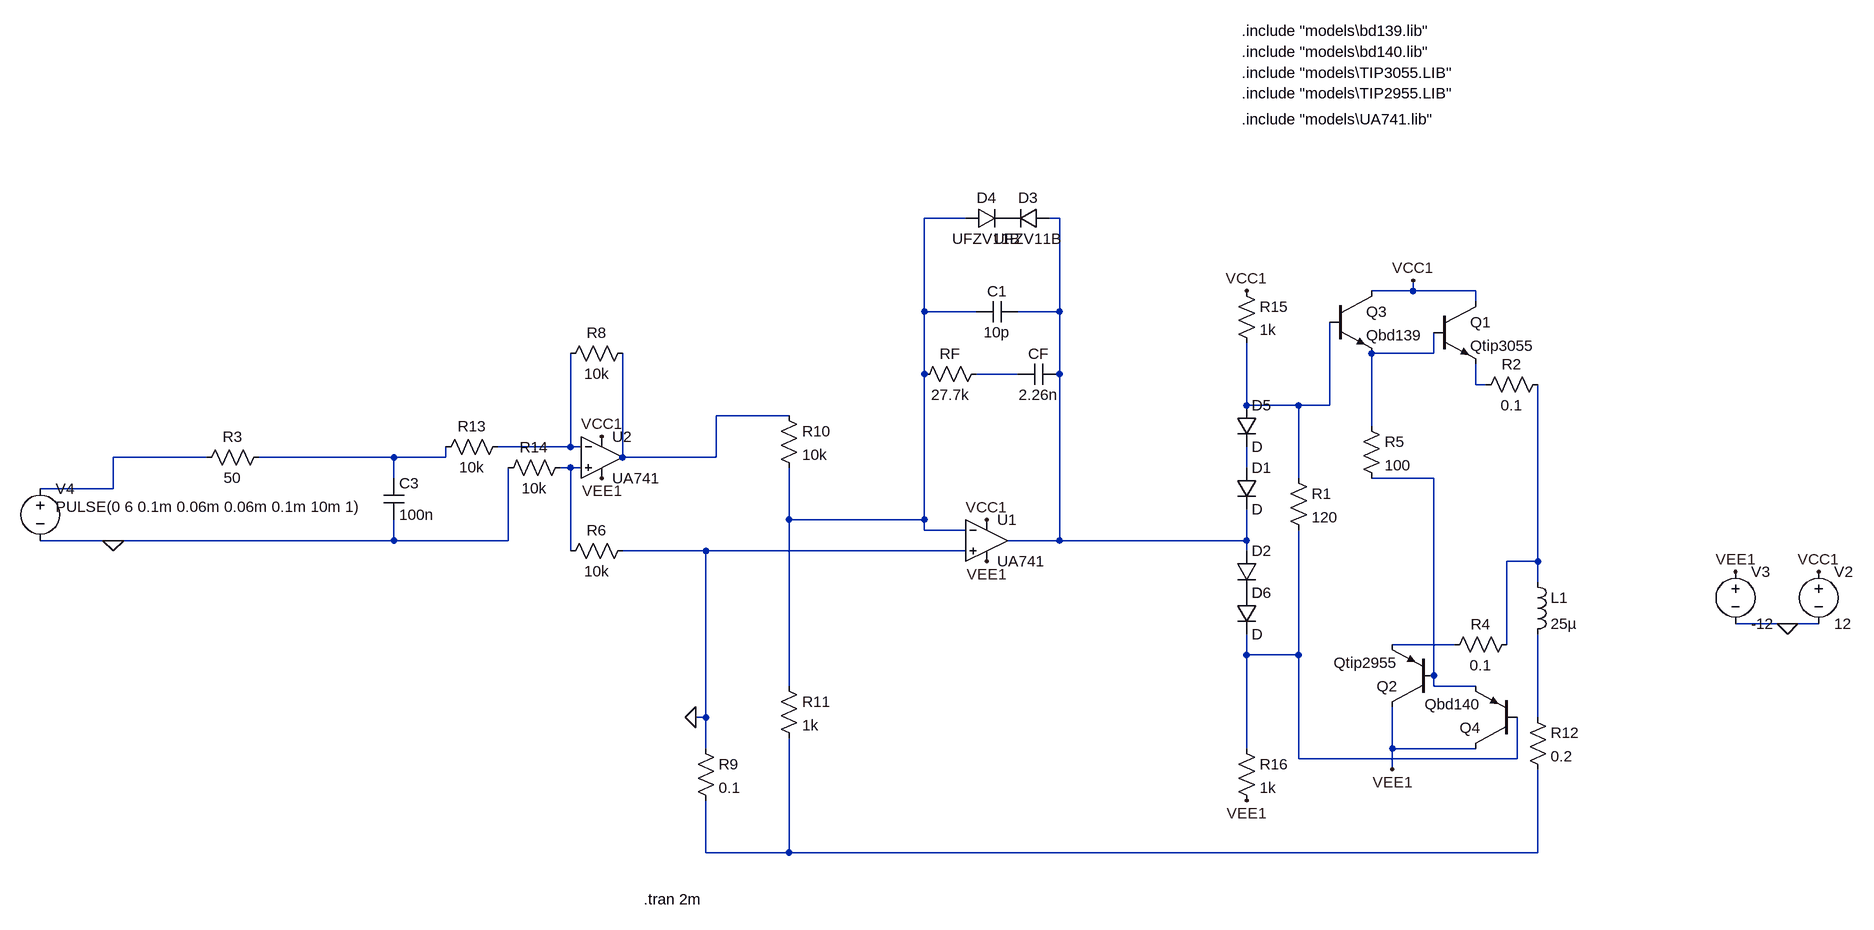
[diagram p0: schematic BJT V1.5.asc]
BJT V1.5.asc, the LTspice schematic file:
Version 4.1
SHEET 1 2440 888
WIRE 688 -176 624 -176
WIRE 832 -176 816 -176
WIRE 1376 -64 1376 -80
WIRE 1376 -64 1312 -64
WIRE 1472 -64 1376 -64
WIRE 1472 -48 1472 -64
WIRE 624 -32 624 -176
WIRE 704 -32 624 -32
WIRE 832 -32 832 -176
WIRE 832 -32 768 -32
WIRE 1408 32 1408 0
WIRE 1408 32 1312 32
WIRE 624 64 624 -32
WIRE 768 64 704 64
WIRE 832 64 832 -32
WIRE 1472 80 1472 48
WIRE 1488 80 1472 80
WIRE 1120 112 1120 16
WIRE 1200 112 1120 112
WIRE 1248 112 1248 -16
WIRE 1248 112 1200 112
WIRE 416 128 304 128
WIRE 1312 144 1312 32
WIRE 80 176 80 32
WIRE 80 176 -32 176
WIRE 96 176 80 176
WIRE -480 192 -624 192
WIRE -192 192 -400 192
WIRE -112 192 -112 176
WIRE -112 192 -192 192
WIRE 160 192 160 32
WIRE 304 192 304 128
WIRE 304 192 160 192
WIRE 80 208 64 208
WIRE 96 208 80 208
WIRE 1120 208 1120 176
WIRE -192 224 -192 192
WIRE 1200 224 1200 112
WIRE 1408 224 1312 224
WIRE -624 240 -624 192
WIRE -624 240 -736 240
WIRE 416 288 416 208
WIRE 624 288 624 64
WIRE 624 288 416 288
WIRE 624 304 624 288
WIRE 688 304 624 304
WIRE -624 320 -736 320
WIRE -192 320 -192 288
WIRE -192 320 -624 320
WIRE -16 320 -16 208
WIRE -16 320 -192 320
WIRE 832 320 832 64
WIRE 832 320 752 320
WIRE 1120 320 1120 272
WIRE 1120 320 832 320
WIRE 80 336 80 208
WIRE 288 336 160 336
WIRE 688 336 288 336
WIRE 1120 336 1120 320
WIRE 1568 352 1568 80
WIRE 1568 352 1520 352
WIRE 1568 384 1568 352
WIRE 1952 448 1872 448
WIRE 2000 448 1952 448
WIRE 1440 480 1344 480
WIRE 1520 480 1520 352
WIRE 1120 496 1120 464
WIRE 1200 496 1200 304
WIRE 1200 496 1120 496
WIRE 1408 528 1408 224
WIRE 416 544 416 288
WIRE 1408 544 1408 528
WIRE 1472 544 1408 544
WIRE 288 592 288 336
WIRE 288 592 272 592
WIRE 1568 592 1568 464
WIRE 288 640 288 592
WIRE 1120 640 1120 496
WIRE 1344 640 1344 576
WIRE 1472 640 1344 640
WIRE 1200 656 1200 496
WIRE 1536 656 1536 592
WIRE 1536 656 1200 656
WIRE 1344 672 1344 640
WIRE 288 800 288 720
WIRE 416 800 416 624
WIRE 416 800 288 800
WIRE 1568 800 1568 672
WIRE 1568 800 416 800
FLAG 2000 368 VCC1
FLAG 1872 368 VEE1
FLAG 1376 -80 VCC1
FLAG 1344 672 VEE1
FLAG 1120 -64 VCC1
FLAG 1120 720 VEE1
FLAG 720 288 VCC1
FLAG 720 352 VEE1
FLAG 272 592 0
FLAG 128 160 VCC1
FLAG 128 224 VEE1
FLAG -624 320 0
FLAG 1952 448 0
SYMBOL res 272 624 R0
SYMATTR InstName R9
SYMATTR Value 0.1
SYMBOL res 400 112 R0
SYMATTR InstName R10
SYMATTR Value 10k
SYMBOL res 400 528 R0
SYMATTR InstName R11
SYMATTR Value 1k
SYMBOL cap 768 -48 R90
WINDOW 0 0 32 VBottom 2
WINDOW 3 32 32 VTop 2
SYMATTR InstName C1
SYMATTR Value 10p
SYMBOL cap 832 48 R90
WINDOW 0 0 32 VBottom 2
WINDOW 3 32 32 VTop 2
SYMATTR InstName CF
SYMATTR Value 2.26n
SYMBOL res 720 48 R90
WINDOW 0 0 56 VBottom 2
WINDOW 3 32 56 VTop 2
SYMATTR InstName RF
SYMATTR Value 27.7k
SYMBOL npn 1408 -48 R0
SYMATTR InstName Q1
SYMATTR Value Qtip3055
SYMBOL pnp 1408 576 R180
SYMATTR InstName Q2
SYMATTR Value Qtip2955
SYMBOL diode 1104 208 R0
SYMATTR InstName D1
SYMBOL diode 1104 336 R0
SYMATTR InstName D2
SYMBOL ind 1552 368 R0
SYMATTR InstName L1
SYMATTR Value 25µ
SYMATTR SpiceLine Rser=1m
SYMBOL res 1552 576 R0
SYMATTR InstName R12
SYMATTR Value 0.2
SYMBOL voltage 2000 352 R0
WINDOW 123 0 0 Left 0
WINDOW 39 0 0 Left 0
SYMATTR InstName V2
SYMATTR Value 12
SYMBOL voltage 1872 352 R0
WINDOW 123 0 0 Left 0
WINDOW 39 0 0 Left 0
SYMATTR InstName V3
SYMATTR Value -12
SYMBOL res 1104 -80 R0
SYMATTR InstName R15
SYMATTR Value 1k
SYMBOL res 1104 624 R0
SYMATTR InstName R16
SYMATTR Value 1k
SYMBOL npn 1248 -64 R0
SYMATTR InstName Q3
SYMATTR Value Qbd139
SYMBOL diode 1104 112 R0
SYMATTR InstName D5
SYMBOL diode 1104 400 R0
SYMATTR InstName D6
SYMBOL pnp 1536 640 R180
SYMATTR InstName Q4
SYMATTR Value Qbd140
SYMBOL voltage -736 224 R0
WINDOW 123 0 0 Left 0
WINDOW 39 0 0 Left 0
WINDOW 3 24 44 Left 2
SYMATTR Value PULSE(0 6 0.1m 0.06m 0.06m 0.1m 10m 1)
SYMATTR InstName V4
SYMBOL res -384 176 R90
WINDOW 0 0 56 VBottom 2
WINDOW 3 32 56 VTop 2
SYMATTR InstName R3
SYMATTR Value 50
SYMBOL OpAmps\\opamp2 720 256 R0
SYMATTR InstName U1
SYMATTR Value UA741
SYMBOL res 1184 208 R0
SYMATTR InstName R1
SYMATTR Value 120
SYMBOL res 1584 64 R90
WINDOW 0 0 56 VBottom 2
WINDOW 3 32 56 VTop 2
SYMATTR InstName R2
SYMATTR Value 0.1
SYMBOL res 1536 464 R90
WINDOW 0 0 56 VBottom 2
WINDOW 3 32 56 VTop 2
SYMATTR InstName R4
SYMATTR Value 0.1
SYMBOL res 1296 128 R0
SYMATTR InstName R5
SYMATTR Value 100
SYMBOL diode 816 -192 R90
WINDOW 0 0 32 VBottom 2
WINDOW 3 32 32 VTop 2
SYMATTR InstName D3
SYMATTR Value UFZV11B
SYMBOL diode 688 -160 R270
WINDOW 0 32 32 VTop 2
WINDOW 3 0 32 VBottom 2
SYMATTR InstName D4
SYMATTR Value UFZV11B
SYMBOL OpAmps\\opamp2 128 128 R0
SYMATTR InstName U2
SYMATTR Value UA741
SYMBOL res 176 320 R90
WINDOW 0 0 56 VBottom 2
WINDOW 3 32 56 VTop 2
SYMATTR InstName R6
SYMATTR Value 10k
SYMBOL res 176 16 R90
WINDOW 0 0 56 VBottom 2
WINDOW 3 32 56 VTop 2
SYMATTR InstName R8
SYMATTR Value 10k
SYMBOL res -16 160 R90
WINDOW 0 0 56 VBottom 2
WINDOW 3 32 56 VTop 2
SYMATTR InstName R13
SYMATTR Value 10k
SYMBOL res 80 192 R90
WINDOW 0 0 56 VBottom 2
WINDOW 3 32 56 VTop 2
SYMATTR InstName R14
SYMATTR Value 10k
SYMBOL cap -208 224 R0
SYMATTR InstName C3
SYMATTR Value 100n
TEXT 192 872 Left 2 !.tran 2m
TEXT 1112 -328 Left 2 !.include "models\\UA741.lib"
TEXT 1112 -368 Left 2 !.include "models\\TIP2955.LIB"
TEXT 1112 -400 Left 2 !.include "models\\TIP3055.LIB"
TEXT 1112 -432 Left 2 !.include "models\\bd140.lib"
TEXT 1112 -464 Left 2 !.include "models\\bd139.lib"

The netlist it stands for:
* BJT V1.5.asc
R9 0 N018 0.1
R10 N007 N001 10k
R11 N001 N018 1k
C1 N002 N001 10p
CF N002 N004 2.26n
RF N004 N001 27.7k
Q1 VCC1 N003 N005 0 Qtip3055
Q2 VEE1 N013 N015 0 Qtip2955
D1 N012 N002 D
D2 N002 P001 D
L1 N014 N017 25µ Rser=1m
R12 N017 N018 0.2
V2 VCC1 0 12
V3 VEE1 0 -12
R15 VCC1 N006 1k
R16 N016 VEE1 1k
Q3 VCC1 N006 N003 0 Qbd139
D5 N006 N012 D
D6 P001 N016 D
Q4 VEE1 N016 N013 0 Qbd140
V4 N009 0 PULSE(0 6 0.1m 0.06m 0.06m 0.1m 10m 1)
R3 N010 N009 50
X§U1 0 N001 VCC1 VEE1 N002 UA741  ; pins In+ In- V+ V- OUT
R1 N006 N016 120
R2 N014 N005 0.1
R4 N014 N015 0.1
R5 N003 N013 100
D3 N002 P002 UFZV11B
D4 N001 P002 UFZV11B
X§U2 N011 N008 VCC1 VEE1 N007 UA741  ; pins In+ In- V+ V- OUT
R6 0 N011 10k
R8 N007 N008 10k
R13 N008 N010 10k
R14 N011 0 10k
C3 N010 0 100n
.model D D
.lib standard.dio
.model NPN NPN
.model PNP PNP
.lib standard.bjt
.tran 2m
.include "models\UA741.lib"
.include "models\TIP2955.LIB"
.include "models\TIP3055.LIB"
.include "models\bd140.lib"
.include "models\bd139.lib"
.backanno
.end